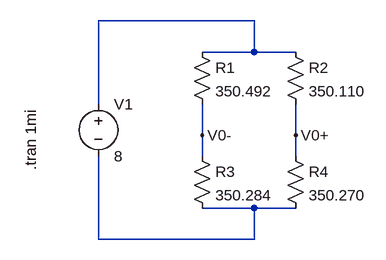
[diagram p0: schematic Wheatstone-Bridge-200g.asc]
Wheatstone-Bridge-200g.asc, the LTspice schematic file:
Version 4.1
SHEET 1 880 680
WIRE 352 -16 112 -16
WIRE 352 32 352 -16
WIRE 352 32 272 32
WIRE 416 32 352 32
WIRE 112 112 112 -16
WIRE 272 160 272 112
WIRE 416 160 416 112
WIRE 272 192 272 160
WIRE 416 192 416 160
WIRE 352 272 272 272
WIRE 416 272 352 272
WIRE 112 320 112 192
WIRE 352 320 352 272
WIRE 352 320 112 320
FLAG 272 160 V0-
FLAG 416 160 V0+
SYMBOL voltage 112 96 R0
WINDOW 123 0 0 Left 0
WINDOW 39 0 0 Left 0
SYMATTR InstName V1
SYMATTR Value 8
SYMBOL res 256 16 R0
SYMATTR InstName R1
SYMATTR Value 350.492
SYMBOL res 400 16 R0
SYMATTR InstName R2
SYMATTR Value 350.110
SYMBOL res 256 176 R0
SYMATTR InstName R3
SYMATTR Value 350.284
SYMBOL res 400 176 R0
SYMATTR InstName R4
SYMATTR Value 350.270
TEXT 8 120 VRight 2 !.tran 1mi

The netlist it stands for:
* Wheatstone-Bridge-200g.asc
V1 N001 N002 8
R1 N001 V0- 350.492
R2 N001 V0+ 350.110
R3 V0- N002 350.284
R4 V0+ N002 350.270
.tran 1mi
.backanno
.end